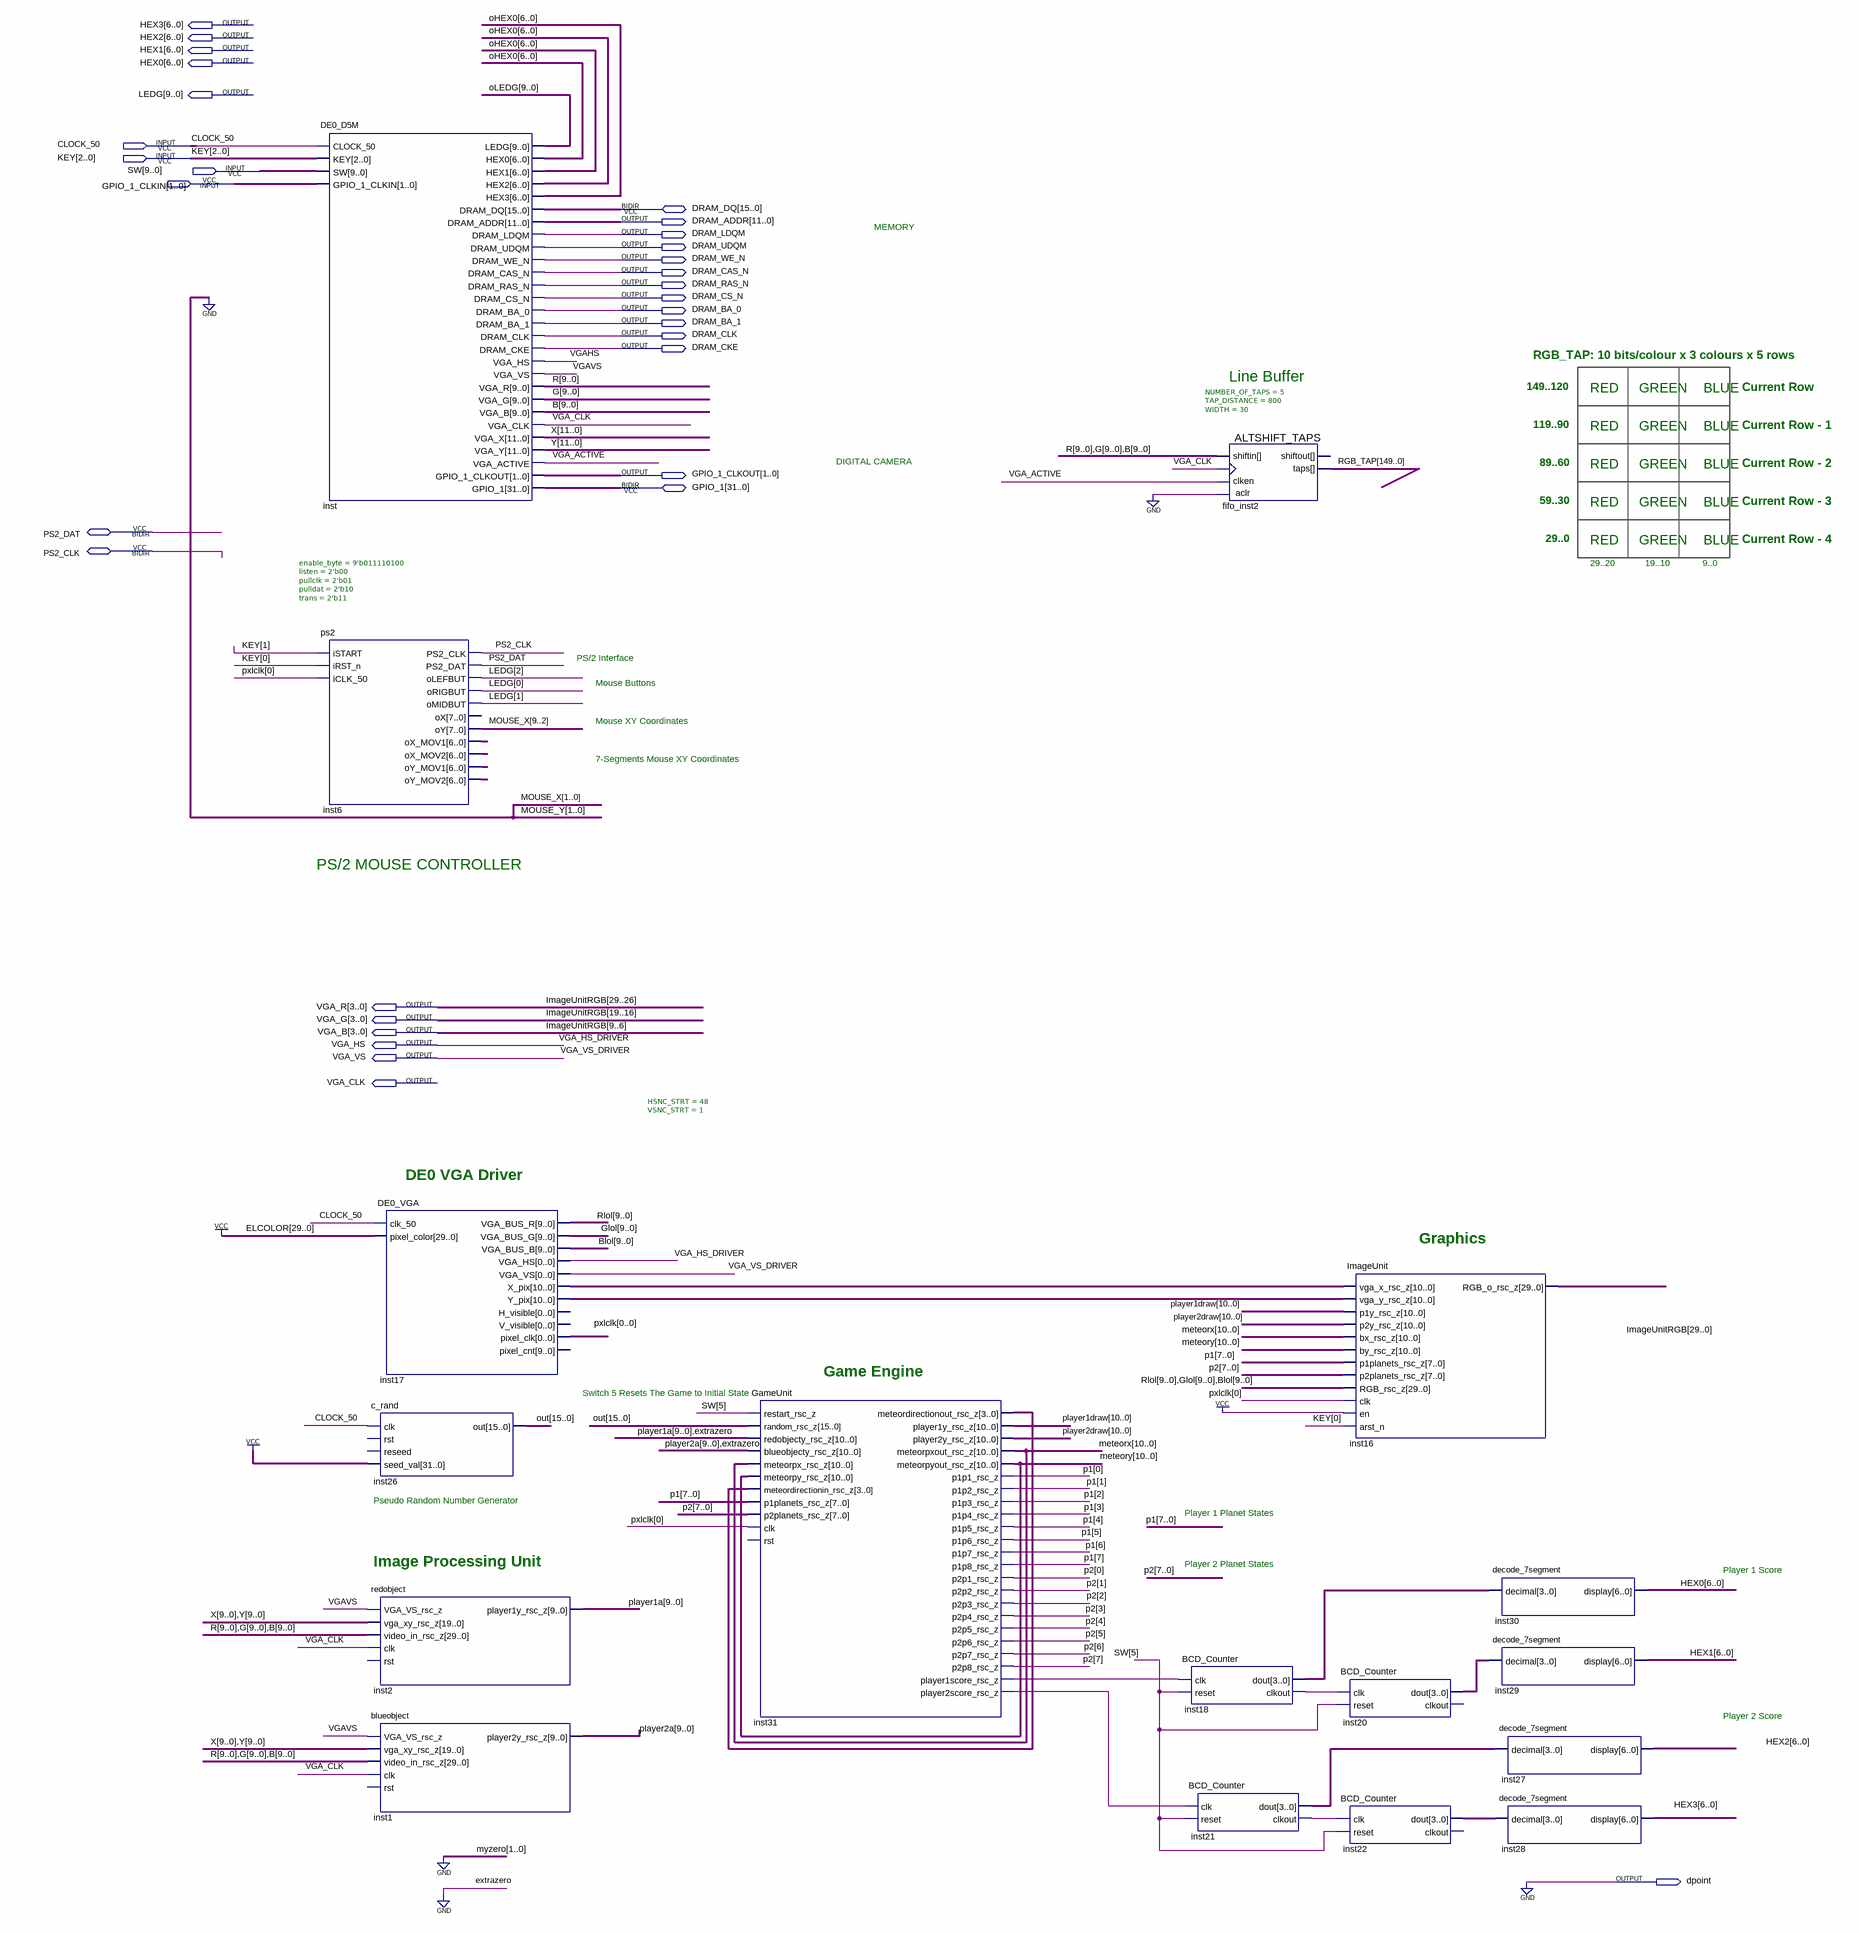
[diagram p0: schematic sheet]
// Quartus schematic TOP_DE0_CAMERA_MOUSE.bdf as structural Verilog: 17 symbols, 32 pins
module TOP_DE0_CAMERA_MOUSE (
  input  CLOCK_50,
  input  [2:0] KEY,
  input  [9:0] SW,
  input  [1:0] GPIO_1_CLKIN,
  inout  [15:0] DRAM_DQ,
  inout  [31:0] GPIO_1,
  inout  PS2_DAT,
  inout  PS2_CLK,
  output [6:0] HEX3,
  output [6:0] HEX2,
  output [6:0] HEX1,
  output [6:0] HEX0,
  output [9:0] LEDG,
  output [11:0] DRAM_ADDR,
  output DRAM_LDQM,
  output DRAM_UDQM,
  output DRAM_WE_N,
  output DRAM_CAS_N,
  output DRAM_RAS_N,
  output DRAM_CS_N,
  output DRAM_BA_0,
  output DRAM_BA_1,
  output DRAM_CLK,
  output DRAM_CKE,
  output [1:0] GPIO_1_CLKOUT,
  output [3:0] VGA_R,
  output [3:0] VGA_G,
  output [3:0] VGA_B,
  output VGA_HS,
  output VGA_VS,
  output VGA_CLK,
  output dpoint
);

  wire inst18_clkout, inst21_clkout, inst31_player1score_rsc_z, inst31_player2score_rsc_z, VGA_ACTIVE, VGAHS,
       VGAVS;
  wire [0:0] pxlclk;
  wire [3:0] inst18_dout, inst20_dout, inst21_dout, inst22_dout, inst31_meteordirectionout_rsc_z;
  wire [6:0] inst6_ox_mov1, inst6_ox_mov2, inst6_oy_mov1, inst6_oy_mov2, oHEX0;
  wire [7:0] p1, p2;
  wire [9:0] B, Blol, G, Glol, oLEDG, player1a, player2a, R, Rlol;
  wire [9:2] MOUSE_X;
  wire [10:0] inst17_x_pix, inst17_y_pix, meteorx, meteory, player1draw, player2draw;
  wire [11:0] X, Y;
  wire [15:0] out;
  wire [25:0] ImageUnitRGB;
  wire [149:0] RGB_TAP;

  DE0_D5M inst (
    .CLOCK_50(CLOCK_50), .KEY(KEY), .SW(SW), .GPIO_1_CLKIN(GPIO_1_CLKIN), .LEDG(oLEDG), .HEX0(oHEX0),
    .HEX1(oHEX0), .HEX2(oHEX0), .HEX3(oHEX0), .DRAM_ADDR(DRAM_ADDR), .DRAM_LDQM(DRAM_LDQM),
    .DRAM_UDQM(DRAM_UDQM), .DRAM_WE_N(DRAM_WE_N), .DRAM_CAS_N(DRAM_CAS_N), .DRAM_RAS_N(DRAM_RAS_N),
    .DRAM_CS_N(DRAM_CS_N), .DRAM_BA_0(DRAM_BA_0), .DRAM_BA_1(DRAM_BA_1), .DRAM_CLK(DRAM_CLK),
    .DRAM_CKE(DRAM_CKE), .VGA_HS(VGAHS), .VGA_VS(VGAVS), .VGA_R(R), .VGA_G(G), .VGA_B(B), .VGA_CLK(VGA_CLK),
    .VGA_X(X), .VGA_Y(Y), .VGA_ACTIVE(VGA_ACTIVE), .GPIO_1_CLKOUT(GPIO_1_CLKOUT), .DRAM_DQ(DRAM_DQ),
    .GPIO_1(GPIO_1));
  ps2 #(.enable_byte(9'b011110100), .listen(2'b00), .pullclk(2'b01), .pulldat(2'b10), .trans(2'b11)) inst6 (
    .iSTART(KEY[1]), .iRST_n(KEY[0]), .iCLK_50(pxlclk[0]), .oLEFBUT(LEDG[2]), .oRIGBUT(LEDG[0]),
    .oMIDBUT(LEDG[1]), .oY(MOUSE_X), .oX_MOV1(inst6_ox_mov1), .oX_MOV2(inst6_ox_mov2),
    .oY_MOV1(inst6_oy_mov1), .oY_MOV2(inst6_oy_mov2), .PS2_CLK(PS2_CLK), .PS2_DAT(PS2_DAT));  // open: oX
  c_rand inst26 (.clk(CLOCK_50), .seed_val({32{1'b1}}), .out(out));  // open: rst, reseed
  redobject inst2 (
    .VGA_VS_rsc_z(VGAVS), .vga_xy_rsc_z({X[9:0], Y[9:0]}), .video_in_rsc_z({R, G, B}), .clk(VGA_CLK),
    .player1y_rsc_z(player1a));  // open: rst
  blueobject inst1 (
    .VGA_VS_rsc_z(VGAVS), .vga_xy_rsc_z({X[9:0], Y[9:0]}), .video_in_rsc_z({R, G, B}), .clk(VGA_CLK),
    .player2y_rsc_z(player2a));  // open: rst
  DE0_VGA #(.HSNC_STRT(48), .VSNC_STRT(1)) inst17 (
    .clk_50(CLOCK_50), .pixel_color({30{1'b1}}), .VGA_BUS_R(Rlol), .VGA_BUS_G(Glol), .VGA_BUS_B(Blol),
    .VGA_HS(VGA_HS), .VGA_VS(VGA_VS), .X_pix(inst17_x_pix), .Y_pix(inst17_y_pix), .pixel_clk(pxlclk[0]));  // open: H_visible, V_visible, pixel_cnt
  GameUnit inst31 (
    .restart_rsc_z(SW[5]), .random_rsc_z(out), .redobjecty_rsc_z({player1a, 1'b0}),
    .blueobjecty_rsc_z({player2a, 1'b0}), .meteorpx_rsc_z(meteorx), .meteorpy_rsc_z(meteory),
    .meteordirectionin_rsc_z(inst31_meteordirectionout_rsc_z), .p1planets_rsc_z(p1), .p2planets_rsc_z(p2),
    .clk(pxlclk[0]), .meteordirectionout_rsc_z(inst31_meteordirectionout_rsc_z),
    .player1y_rsc_z(player1draw), .player2y_rsc_z(player2draw), .meteorpxout_rsc_z(meteorx),
    .meteorpyout_rsc_z(meteory), .p1p1_rsc_z(p1[0]), .p1p2_rsc_z(p1[1]), .p1p3_rsc_z(p1[2]),
    .p1p4_rsc_z(p1[3]), .p1p5_rsc_z(p1[4]), .p1p6_rsc_z(p1[5]), .p1p7_rsc_z(p1[6]), .p1p8_rsc_z(p1[7]),
    .p2p1_rsc_z(p2[0]), .p2p2_rsc_z(p2[1]), .p2p3_rsc_z(p2[2]), .p2p4_rsc_z(p2[3]), .p2p5_rsc_z(p2[4]),
    .p2p6_rsc_z(p2[5]), .p2p7_rsc_z(p2[6]), .p2p8_rsc_z(p2[7]),
    .player1score_rsc_z(inst31_player1score_rsc_z), .player2score_rsc_z(inst31_player2score_rsc_z));  // open: rst
  BCD_Counter inst18 (.clk(inst31_player1score_rsc_z), .reset(SW[5]), .dout(inst18_dout), .clkout(inst18_clkout));
  ALTSHIFT_TAPS #(.NUMBER_OF_TAPS(5), .TAP_DISTANCE(800), .WIDTH(30)) fifo_inst2 (
    .shiftin({R, G, B}), .clken(VGA_ACTIVE), .clock(VGA_CLK), .aclr(1'b0), .taps(RGB_TAP));  // open: shiftout
  BCD_Counter inst21 (.clk(inst31_player2score_rsc_z), .reset(SW[5]), .dout(inst21_dout), .clkout(inst21_clkout));
  ImageUnit inst16 (
    .vga_x_rsc_z(inst17_x_pix), .vga_y_rsc_z(inst17_y_pix), .p1y_rsc_z(player1draw), .p2y_rsc_z(player2draw),
    .bx_rsc_z(meteorx), .by_rsc_z(meteory), .p1planets_rsc_z(p1), .p2planets_rsc_z(p2),
    .RGB_rsc_z({Rlol, Glol, Blol}), .clk(pxlclk[0]), .en(1'b1), .arst_n(KEY[0]),
    .RGB_o_rsc_z({VGA_R, ImageUnitRGB[25:20], VGA_G, ImageUnitRGB[15:10], VGA_B, ImageUnitRGB[5:0]}));
  BCD_Counter inst20 (.clk(inst18_clkout), .reset(SW[5]), .dout(inst20_dout));  // open: clkout
  BCD_Counter inst22 (.clk(inst21_clkout), .reset(SW[5]), .dout(inst22_dout));  // open: clkout
  decode_7segment inst30 (.decimal(inst18_dout), .display(HEX0));
  decode_7segment inst29 (.decimal(inst20_dout), .display(HEX1));
  decode_7segment inst27 (.decimal(inst21_dout), .display(HEX2));
  decode_7segment inst28 (.decimal(inst22_dout), .display(HEX3));

  assign dpoint = 1'b0;

  // Other names for the same wires on the sheet: ImageUnitRGB (some bits) = {VGA_R, VGA_G, VGA_B};
  //   VGA_HS_DRIVER = VGA_HS; VGA_VS_DRIVER = VGA_VS

  // Notes on the sheet:
  //   MEMORY
  //   RGB_TAP: 10 bits/colour x 3 colours x 5 rows
  //   Line Buffer
  //   149..120
  //   RED     GREEN    BLUE
  //   Current Row
  //   119..90
  //   RED     GREEN    BLUE
  //   Current Row - 1
  //   DIGITAL CAMERA
  //   89..60
  //   RED     GREEN    BLUE
  //   Current Row - 2
  //   59..30
  //   RED     GREEN    BLUE
  //   Current Row - 3
  //   29..0
  //   RED     GREEN    BLUE
  //   Current Row - 4
  //   29..20            19..10             9..0
  //   PS/2 Interface
  //   Mouse Buttons
  //   Mouse XY Coordinates
  //   7-Segments Mouse XY Coordinates
  //   PS/2 MOUSE CONTROLLER
  //   DE0 VGA Driver
  //   Graphics
  //   Game Engine
  //   Switch 5 Resets The Game to Initial State
  //   Pseudo Random Number Generator
  //   Player 1 Planet States
  //   Image Processing Unit
  //   Player 2 Planet States
  //   Player 1 Score
  //   Player 2 Score
endmodule
